# Altium schematic sheet Smartwatch_SensorsAndPeripherals.SchDoc
size A4; SheetNumber: 1; SheetTotal: 4
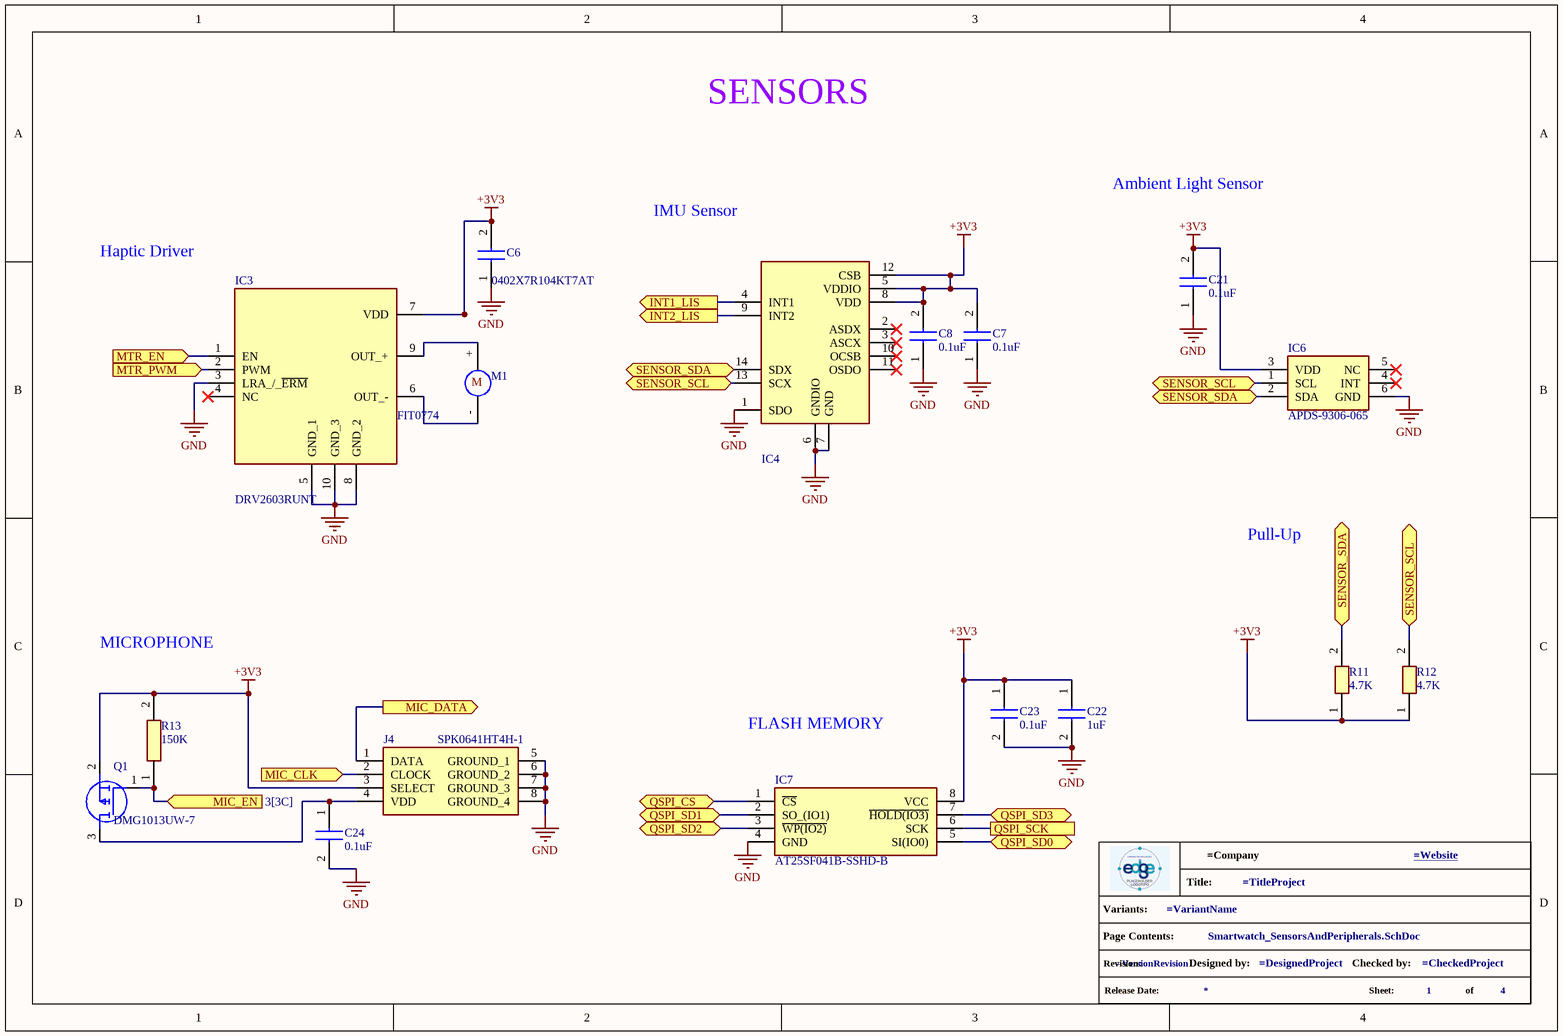
[diagram p0: Smartwatch_SensorsAndPeripherals.SchDoc]

## Parts
*?  info_project  (value not drawn)  (graphical)
C6  0402X7R104KT7AT  [CAPC1005X61N]
C7  0.1uF  [CAPC1005X61N]
C8  0.1uF  [CAPC1005X61N]
C21  0.1uF  [CAPC1005X61N]
C22  1uF  [CAPC1005X65N]
C23  0.1uF  [CAPC1005X61N]
C24  0.1uF  [CAPC1005X61N]
IC3  DRV2603RUNT  [QFN50P200X200X80-10N-D]
IC4  BMI270  [BMI270]  (value not drawn)
IC6  APDS-9306-065  [APDS9306065]
IC7  AT25SF041B-SSHD-B  [SOIC127P600X175-8N]
J4  SPK0641HT4H-1  [SPK0641HT4H1]
M1  FIT0774  [FIT0774]
Q1  DMG1013UW-7  [SOT65P210X110-3N]
R11  4.7K  [ERJPA2_(0402)]
R12  4.7K  [ERJPA2_(0402)]
R13  150K  [RESC1608X55N]

## Ports
INT1_LIS (out, see 3[1C]), INT2_LIS (out, see 3[2D]), MIC_CLK (in, see 3[1D]), MIC_DATA (out, see 3[1C]), MIC_EN (in, see 3[3C]), MTR_EN (in, see 3[2C]), MTR_PWM (in, see 3[2C]), QSPI_CS (bidir, see 3[1C]), QSPI_SCK (see 3[1D]), QSPI_SD0 (bidir, see 3[1C]), QSPI_SD1 (bidir, see 3[1C]), QSPI_SD2 (bidir, see 3[1C]), QSPI_SD3 (bidir, see 3[1D]), SENSOR_SCL (bidir, see 1[2B], 1[3B], 3[1B]), SENSOR_SCL (bidir, see 1[2B], 1[4C], 3[1B]), SENSOR_SCL (bidir, see 1[3B], 1[4C], 3[1B]), SENSOR_SDA (bidir, see 1[2B], 1[3B], 3[1B]), SENSOR_SDA (bidir, see 1[2B], 1[4C], 3[1B]), SENSOR_SDA (bidir, see 1[3B], 1[4C], 3[1B])

## Nets
+3V3: C6.2 C7.2 C8.2 C21.2 C22.1 C23.1 IC3.7(VDD) IC4.5(VDDIO) IC4.8(VDD) IC4.12(CSB) IC6.3(VDD) IC7.8(VCC) J4.3(SELECT) Q1.2(S) R11.1 R12.1 R13.2
GND: C6.1 C7.1 C8.1 C21.1 C22.2 C23.2 C24.2 IC3.3(LRA_/_~{ERM}) IC3.5(GND_1) IC3.8(GND_2) IC3.10(GND_3) IC4.1(SDO) IC4.6(GNDIO) IC4.7(GND) IC6.6(GND) IC7.4(GND) J4.5(GROUND_1) J4.6(GROUND_2) J4.7(GROUND_3) J4.8(GROUND_4)
INT1_LIS: IC4.4(INT1) ; port INT1_LIS
INT2_LIS: IC4.9(INT2) ; port INT2_LIS
MIC_CLK: J4.2(CLOCK) ; port MIC_CLK
MIC_DATA: J4.1(DATA) ; port MIC_DATA
MIC_EN: Q1.1(G) R13.1 ; port MIC_EN
MTR_EN: IC3.1(EN) ; port MTR_EN
MTR_PWM: IC3.2(PWM) ; port MTR_PWM
QSPI_CS: IC7.1(~{CS}) ; port QSPI_CS
QSPI_SCK: IC7.6(SCK) ; port QSPI_SCK
QSPI_SD0: IC7.5(SI(IO0)) ; port QSPI_SD0
QSPI_SD1: IC7.2(SO_(IO1)) ; port QSPI_SD1
QSPI_SD2: IC7.3(~{WP(IO2)}) ; port QSPI_SD2
QSPI_SD3: IC7.7(~{HOLD(IO3)}) ; port QSPI_SD3
SENSOR_SCL: IC4.13(SCX) IC6.1(SCL) R12.2 ; port SENSOR_SCL
SENSOR_SDA: IC4.14(SDX) IC6.2(SDA) R11.2 ; port SENSOR_SDA
NetC24_1: C24.1 J4.4(VDD) Q1.3(D)
NetIC3_6: IC3.6(OUT_-) M1.-
NetIC3_9: IC3.9(OUT_+) M1.+

Not connected (* = marked no-connect by the designer): IC3 4(NC)*; IC4 2(ASDX)* 3(ASCX)* 10(OCSB)* 11(OSDO)*; IC6 4(INT)* 5(NC)*

## Notes on the sheet
- SENSORS
- IMU Sensor
- Ambient Light Sensor
- Haptic Driver
- Pull-Up
- MICROPHONE
- FLASH MEMORY
- (in symbol FIT0774) M
- (in symbol info_project) Title:; Variants:; Page Contents:; Revision:; Designed by:; Checked by:; Release Date:; Sheet:; of

## Library data of the parts
C6-C8 C21 C23 C24 = 0402X7R104KT7AT: Multilayer Ceramic Capacitors MLCC - SMD/SMT 16V 0.1uF X7R 10%; Manufacturer_Name: Kyocera AVX; Datasheet Link: https://www.mouser.es/datasheet/2/40/general_purpose-3169586.pdf; Height: 0.61mm; Manufacturer_Part_Number: 0402X7R104KT7AT; Mouser Part Number: 581-0402X7R104KT7AT; Mouser Price/Stock: https://www.mouser.co.uk/ProductDetail/KYOCERA-AVX/0402X7R104KT7AT?qs=DPoM0jnrROXD467pFR2ukA%3D%3D
C22 = CC0402KRX5R6BB105: Multilayer Ceramic Capacitors MLCC - SMD/SMT 10V 1uF X5R 0402 10% HI CV; Manufacturer_Name: YAGEO; Datasheet Link: https://www.yageo.com/upload/media/product/app/datasheet/mlcc/upy-gphc_x5r_4v-to-50v.pdf; Height: 0.55mm; Manufacturer_Part_Number: CC0402KRX5R6BB105; Mouser Part Number: 603-CC402KRX5R6BB105; Mouser Price/Stock: https://www.mouser.co.uk/ProductDetail/YAGEO/CC0402KRX5R6BB105?qs=BKNoF%2F0xMNu0TvpE6ze2Iw%3D%3D; Arrow Part Number: CC0402KRX5R6BB105; Arrow Price/Stock: https://www.arrow.com/en/products/cc0402krx5r6bb105/yageo?region=nac
IC3 = DRV2603RUNT: Motor / Motion / Ignition Controllers & Drivers Haptic Driver w/Auto Resonance Tracking; Manufacturer_Name: Texas Instruments; Datasheet Link: http://www.ti.com/lit/ds/symlink/drv2603.pdf; Height: 0.8mm; Manufacturer_Part_Number: DRV2603RUNT; Mouser Part Number: 595-DRV2603RUNT; Mouser Price/Stock: https://www.mouser.co.uk/ProductDetail/Texas-Instruments/DRV2603RUNT?qs=y0LsnOHuQQ66fXxKAgGo4A%3D%3D; Arrow Part Number: DRV2603RUNT; Arrow Price/Stock: https://www.arrow.com/en/products/drv2603runt/texas-instruments
IC4 = BMI270: IMUs - Inertial Measurement Units Smart Ultra-Low Power Inertial Measurement Unit (IMU) for Wearable Applications; Manufacturer_Name: BOSCH; Datasheet Link: https://www.bosch-sensortec.com/media/boschsensortec/downloads/datasheets/bst-bmi270-ds000.pdf; Height: 0.87mm; Manufacturer_Part_Number: BMI270; Mouser Part Number: 262-BMI270; Mouser Price/Stock: https://www.mouser.co.uk/ProductDetail/Bosch-Sensortec/BMI270?qs=u16ybLDytRYIj%252BjQEee88A%3D%3D; Arrow Part Number: BMI270; Arrow Price/Stock: https://www.arrow.com/en/products/bmi270/bosch?utm_currency=USD&region=nac
IC6 = APDS-9306-065: Ambient Light Sensors Digital Ambient Light Sensor; Manufacturer_Name: Avago Technologies; Datasheet Link: A19870331a; Height: 0.75mm; Manufacturer_Part_Number: APDS-9306-065; Mouser Part Number: 630-APDS-9306-065; Mouser Price/Stock: https://www.mouser.co.uk/ProductDetail/Broadcom-Avago/APDS-9306-065?qs=JUmsgfbaopRTut8Cx4p19A%3D%3D
IC7 = AT25SF041B-SSHD-B: NOR Flash 4 Mbit, 3.0V (2.5V to 3.6V), -40C to 85C, SOIC-N 150mil (Tube), Single, Dual, Quad SPI NOR Flash; Manufacturer_Name: Renesas Electronics; Datasheet Link: https://www.mouser.in/datasheet/2/698/REN_DS_AT25SF041B_190H_062022_DST_20220603_1-3076039.pdf; Height: 1.75mm; Manufacturer_Part_Number: AT25SF041B-SSHD-B; Mouser Part Number: 988-AT25SF041BSSHDB; Mouser Price/Stock: https://www.mouser.co.uk/ProductDetail/Renesas-Dialog/AT25SF041B-SSHD-B?qs=IS%252B4QmGtzzoAv7Cb4U2tFA%3D%3D
J4 = SPK0641HT4H-1: Microfones MEMS SISONIC MEMS MICROPHONE;Digital;Top;64.5dB SNR;120dB SPL;-26 +/-1dBV;35Hz;70dB PSRR;Low Power: 230 / Standard: 630;1.8V; Manufacturer_Name: Knowles Johanson Manufacturing; Datasheet Link: https://www.knowles.com/docs/default-source/model-downloads/spk0641ht4h-1-rev-a.pdf; Height: 1.1mm; Manufacturer_Part_Number: SPK0641HT4H-1; Mouser Part Number: 721-SPK0641HT4H-1; Mouser Price/Stock: https://www.mouser.com/Search/Refine.aspx?Keyword=721-SPK0641HT4H-1
M1 = FIT0774: Mini Vibration Motor (10*2.7MM); Manufacturer: DFRobot; Supplier: Mouser; Supplier Part Number: 426-FIT0774; Manufacturer Part Number: FIT0774; RoHS: No; Category: Motors and Drives; Stock: 3316; Pricing: 1=0,99, 10=0,99, 50=0,99, 100=0,99, 1000=0,99, 10000=0,99 (USD)
Q1 = DMG1013UW-7: MOSFET (P-Channel); Manufacturer_Name: Diodes Incorporated; Datasheet Link: https://www.diodes.com//assets/Datasheets/ds31861.pdf; Height: 1.1mm; Manufacturer_Part_Number: DMG1013UW-7; Mouser Part Number: 621-DMG1013UW-7; Mouser Price/Stock: https://www.mouser.co.uk/ProductDetail/Diodes-Incorporated/DMG1013UW-7?qs=GWgl%252BsiMZr9p7lJcuAyJvw%3D%3D; Arrow Part Number: DMG1013UW-7; Arrow Price/Stock: https://www.arrow.com/en/products/dmg1013uw-7/diodes-incorporated?region=nac
R11 R12 = ERJ-PA2F4701X: Thick Film Resistors - SMD 0402 1% 4.7Kohm Anti-Surge AEC-Q200; Manufacturer_Name: Panasonic; Datasheet Link: http://industrial.panasonic.com/cdbs/www-data/pdf/RDO0000/AOA0000C331.pdf; Height: 0.4mm; Manufacturer_Part_Number: ERJ-PA2F4701X; Mouser Part Number: 667-ERJ-PA2F4701X; Mouser Price/Stock: https://www.mouser.co.uk/ProductDetail/Panasonic/ERJ-PA2F4701X?qs=h9NfwcE6J0JdNXujYyUhOg%3D%3D; Arrow Part Number: ERJ-PA2F4701X; Arrow Price/Stock: https://www.arrow.com/en/products/erj-pa2f4701x/panasonic?region=nac
R13 = RK73B1JTTDD154J: Thick Film Resistors - SMD 1/10W 150K OHM 5%; Manufacturer_Name: KOA Speer; Datasheet Link: http://www.koaspeer.com/catimages/Products/RK73-RT/RK73-RT.pdf; Height: 0.55mm; Manufacturer_Part_Number: RK73B1JTTDD154J; Mouser Part Number: 660-RK73B1JTTDD154J; Mouser Price/Stock: https://www.mouser.co.uk/ProductDetail/KOA-Speer/RK73B1JTTDD154J?qs=eQc%252BYniTHCffTX8fUgD2hw%3D%3D